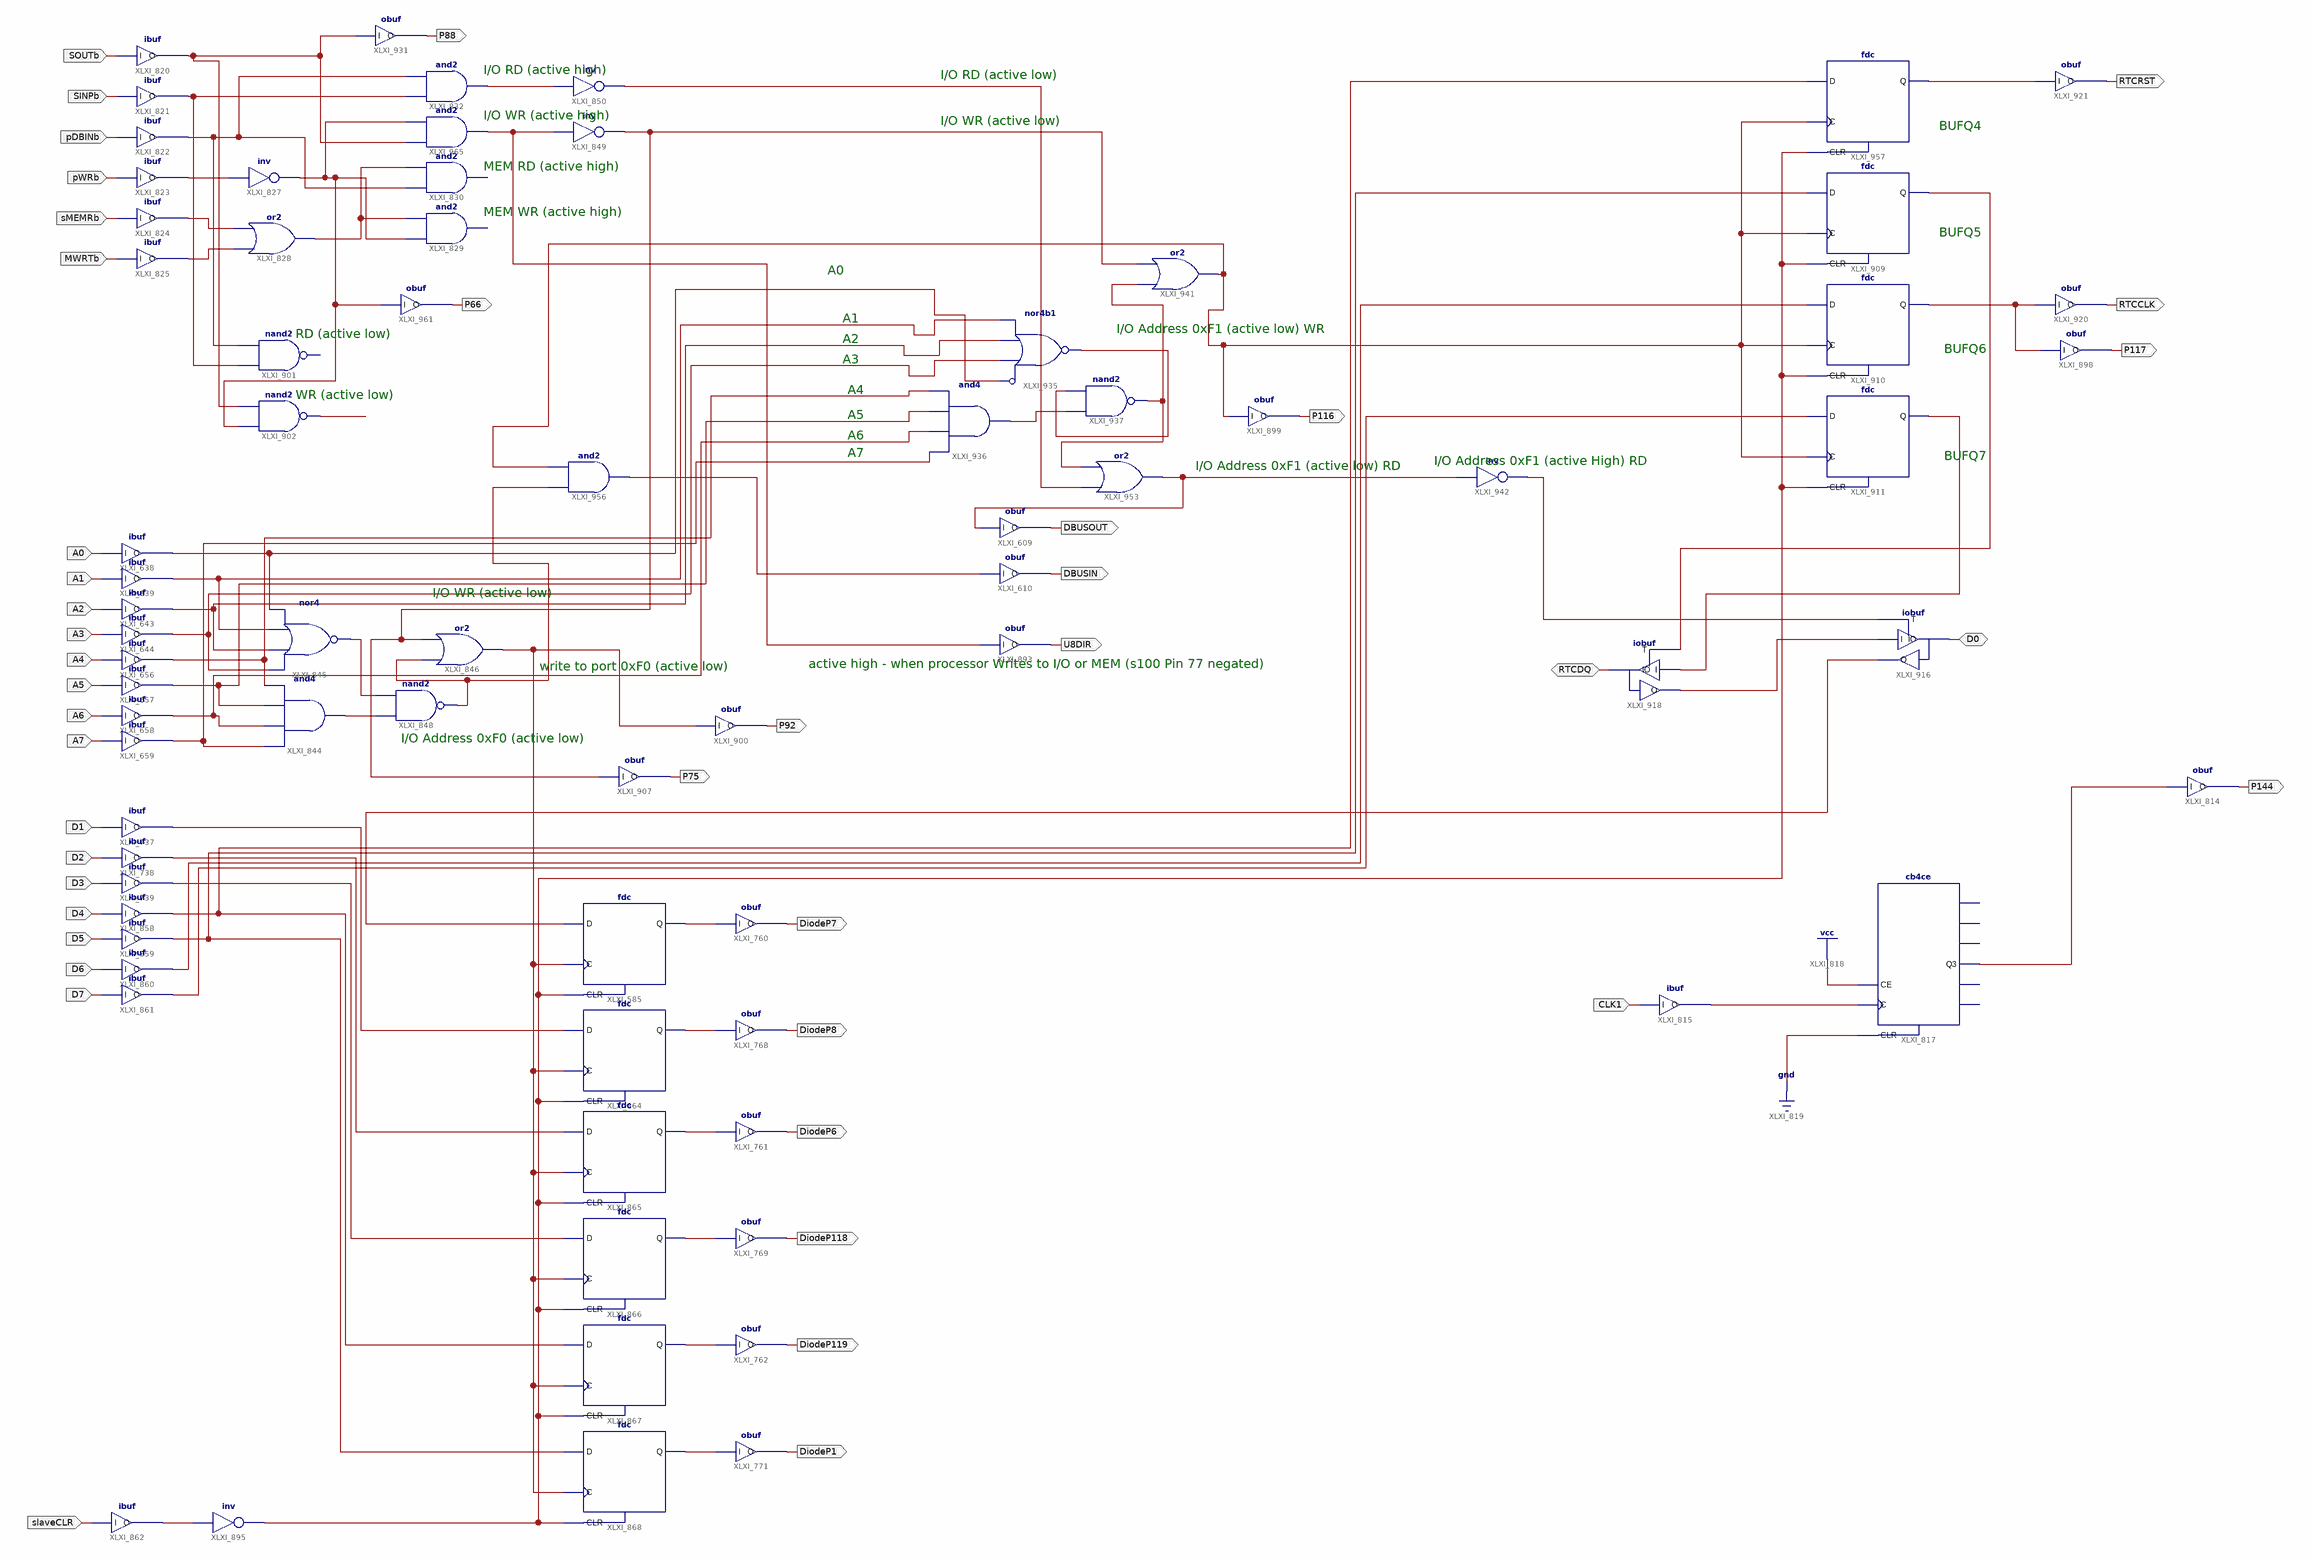
[diagram p0: schematic sheet 1]
// Xilinx ISE schematic U30v3.sch (spartan6) as structural Verilog: 76 symbols, 43 ports
module U30v3 (
  input  CLK1,
  input  SOUTb,
  input  SINPb,
  input  pDBINb,
  input  pWRb,
  input  sMEMRb,
  input  MWRTb,
  input  A0,
  input  A1,
  input  A2,
  input  A3,
  input  A4,
  input  A5,
  input  A6,
  input  A7,
  input  D1,
  input  D2,
  input  D3,
  input  D4,
  input  D5,
  input  D6,
  input  D7,
  input  slaveCLR,
  inout  RTCDQ,
  inout  D0,
  output P144,
  output DBUSOUT,
  output DBUSIN,
  output DiodeP7,
  output DiodeP8,
  output DiodeP6,
  output DiodeP118,
  output DiodeP119,
  output U8DIR,
  output P92,
  output RTCCLK,
  output RTCRST,
  output P116,
  output DiodeP1,
  output P117,
  output P75,
  output P88,
  output P66
);

  wire XLXN_1123, XLXN_1124, XLXN_1134, XLXN_1135, XLXN_1137, XLXN_1138, XLXN_1158, XLXN_1160, XLXN_1162,
       XLXN_1202, XLXN_1203, XLXN_1207, XLXN_1208, XLXN_1209, XLXN_1210, XLXN_1211, XLXN_1212, XLXN_1214,
       XLXN_1235, XLXN_1244, XLXN_1246, XLXN_1255, XLXN_1257, XLXN_1263, XLXN_1264, XLXN_1265, XLXN_1269,
       XLXN_1276, XLXN_1277, XLXN_1278, XLXN_1289, XLXN_1294, XLXN_1296, XLXN_1314, XLXN_1315, XLXN_1316,
       XLXN_1322, XLXN_1328, XLXN_1329, XLXN_1330, XLXN_1331, XLXN_1332, XLXN_1340, XLXN_1347, XLXN_1351,
       XLXN_1352, XLXN_1353, XLXN_1357, XLXN_1366, XLXN_1369, XLXN_1370, XLXN_1373, XLXN_1385, XLXN_1386,
       XLXN_1389;

  obuf XLXI_814 (.I(XLXN_1124), .O(P144));
  cb4ce XLXI_817 (.C(XLXN_1123), .CE(1'b1), .CLR(1'b0), .Q3(XLXN_1124));  // open: CEO, Q0, Q1, Q2, TC
  ibuf XLXI_815 (.I(CLK1), .O(XLXN_1123));
  ibuf XLXI_820 (.I(SOUTb), .O(XLXN_1389));
  ibuf XLXI_821 (.I(SINPb), .O(XLXN_1246));
  ibuf XLXI_822 (.I(pDBINb), .O(XLXN_1137));
  ibuf XLXI_823 (.I(pWRb), .O(XLXN_1385));
  ibuf XLXI_824 (.I(sMEMRb), .O(XLXN_1134));
  ibuf XLXI_825 (.I(MWRTb), .O(XLXN_1135));
  not XLXI_827 (XLXN_1386, XLXN_1385);
  or XLXI_828 (XLXN_1138, XLXN_1135, XLXN_1134);
  // and2 XLXI_829 has open pins: I0=XLXN_1386, I1=XLXN_1138, O=open
  // and2 XLXI_830 has open pins: I0=XLXN_1137, I1=XLXN_1138, O=open
  and XLXI_832 (XLXN_1162, XLXN_1246, XLXN_1137);
  ibuf XLXI_638 (.I(A0), .O(XLXN_1322));
  ibuf XLXI_639 (.I(A1), .O(XLXN_1329));
  ibuf XLXI_643 (.I(A2), .O(XLXN_1330));
  ibuf XLXI_644 (.I(A3), .O(XLXN_1328));
  ibuf XLXI_656 (.I(A4), .O(XLXN_1316));
  ibuf XLXI_657 (.I(A5), .O(XLXN_1315));
  ibuf XLXI_658 (.I(A6), .O(XLXN_1314));
  ibuf XLXI_659 (.I(A7), .O(XLXN_1158));
  and XLXI_844 (XLXN_1269, XLXN_1158, XLXN_1314, XLXN_1315, XLXN_1316);
  nor XLXI_845 (XLXN_1160, XLXN_1328, XLXN_1330, XLXN_1329, XLXN_1322);
  or XLXI_846 (XLXN_1353, XLXN_1352, XLXN_1257);
  nand XLXI_848 (XLXN_1352, XLXN_1269, XLXN_1160);
  not XLXI_849 (XLXN_1257, XLXN_1244);
  not XLXI_850 (XLXN_1235, XLXN_1162);
  obuf XLXI_610 (.I(XLXN_1255), .O(DBUSIN));
  obuf XLXI_609 (.I(XLXN_1370), .O(DBUSOUT));
  ibuf XLXI_737 (.I(D1), .O(XLXN_1208));
  ibuf XLXI_738 (.I(D2), .O(XLXN_1209));
  ibuf XLXI_739 (.I(D3), .O(XLXN_1210));
  ibuf XLXI_858 (.I(D4), .O(XLXN_1211));
  ibuf XLXI_859 (.I(D5), .O(XLXN_1212));
  ibuf XLXI_860 (.I(D6), .O(XLXN_1278));
  ibuf XLXI_861 (.I(D7), .O(XLXN_1277));
  fdc XLXI_585 (.C(XLXN_1353), .CLR(XLXN_1276), .D(XLXN_1207), .Q(XLXN_1263));
  fdc XLXI_864 (.C(XLXN_1353), .CLR(XLXN_1276), .D(XLXN_1208), .Q(XLXN_1264));
  fdc XLXI_865 (.C(XLXN_1353), .CLR(XLXN_1276), .D(XLXN_1209), .Q(XLXN_1203));
  fdc XLXI_866 (.C(XLXN_1353), .CLR(XLXN_1276), .D(XLXN_1210), .Q(XLXN_1202));
  fdc XLXI_867 (.C(XLXN_1353), .CLR(XLXN_1276), .D(XLXN_1211), .Q(XLXN_1265));
  fdc XLXI_868 (.C(XLXN_1353), .CLR(XLXN_1276), .D(XLXN_1212), .Q(XLXN_1357));
  obuf XLXI_760 (.I(XLXN_1263), .O(DiodeP7));
  obuf XLXI_768 (.I(XLXN_1264), .O(DiodeP8));
  obuf XLXI_761 (.I(XLXN_1203), .O(DiodeP6));
  obuf XLXI_769 (.I(XLXN_1202), .O(DiodeP118));
  obuf XLXI_762 (.I(XLXN_1265), .O(DiodeP119));
  obuf XLXI_893 (.I(XLXN_1244), .O(U8DIR));
  ibuf XLXI_862 (.I(slaveCLR), .O(XLXN_1214));
  not XLXI_895 (XLXN_1276, XLXN_1214);
  obuf XLXI_900 (.I(XLXN_1353), .O(P92));
  // nand2 XLXI_901 has open pins: I0=XLXN_1246, I1=XLXN_1137, O=open
  nand XLXI_902 (XLXN_1347, XLXN_1386, XLXN_1389);
  fdc XLXI_909 (.C(XLXN_1351), .CLR(XLXN_1276), .D(XLXN_1212), .Q(XLXN_1294));
  fdc XLXI_910 (.C(XLXN_1351), .CLR(XLXN_1276), .D(XLXN_1278), .Q(XLXN_1369));
  fdc XLXI_911 (.C(XLXN_1351), .CLR(XLXN_1276), .D(XLXN_1277), .Q(XLXN_1296));
  iobuf XLXI_916 (.I(XLXN_1373), .IO(D0), .O(XLXN_1207), .T(XLXN_1289));
  iobuf XLXI_918 (.I(XLXN_1296), .IO(RTCDQ), .O(XLXN_1373), .T(XLXN_1294));
  obuf XLXI_920 (.I(XLXN_1369), .O(RTCCLK));
  obuf XLXI_921 (.I(XLXN_1366), .O(RTCRST));
  nor XLXI_935 (XLXN_1331, ~XLXN_1322, XLXN_1328, XLXN_1330, XLXN_1329);  // nor4b1
  and XLXI_936 (XLXN_1332, XLXN_1158, XLXN_1314, XLXN_1315, XLXN_1316);
  nand XLXI_937 (XLXN_1340, XLXN_1332, XLXN_1331);
  obuf XLXI_899 (.I(XLXN_1351), .O(P116));
  or XLXI_941 (XLXN_1351, XLXN_1340, XLXN_1257);
  not XLXI_942 (XLXN_1289, XLXN_1370);
  obuf XLXI_771 (.I(XLXN_1357), .O(DiodeP1));
  or XLXI_953 (XLXN_1370, XLXN_1235, XLXN_1340);
  obuf XLXI_898 (.I(XLXN_1369), .O(P117));
  and XLXI_956 (XLXN_1255, XLXN_1352, XLXN_1351);
  fdc XLXI_957 (.C(XLXN_1351), .CLR(XLXN_1276), .D(XLXN_1211), .Q(XLXN_1366));
  obuf XLXI_907 (.I(XLXN_1257), .O(P75));
  and XLXI_965 (XLXN_1244, XLXN_1389, XLXN_1386);
  obuf XLXI_931 (.I(XLXN_1389), .O(P88));
  obuf XLXI_961 (.I(XLXN_1386), .O(P66));

  // Notes on the sheet:
  //   I/O RD (active high)
  //   I/O RD (active low)
  //   I/O WR (active high)
  //   I/O WR (active low)
  //   BUFQ4
  //   MEM RD (active high)
  //   MEM WR (active high)
  //   BUFQ5
  //   A0
  //   A1
  //   I/O Address 0xF1 (active low) WR
  //   RD (active low)
  //   A2
  //   BUFQ6
  //   A3
  //   A4
  //   WR (active low)
  //   A5
  //   A6
  //   A7
  //   BUFQ7
  //   I/O Address 0xF1 (active High) RD
  //   I/O Address 0xF1 (active low) RD
  //   I/O WR (active low)
  //   active high - when processor Writes to I/O or MEM (s100 Pin 77 negated)
  //   write to port 0xF0 (active low)
  //   I/O Address 0xF0 (active low)
endmodule
